# EAGLE design boardv2_copy3 (EAGLE 7.7.0)
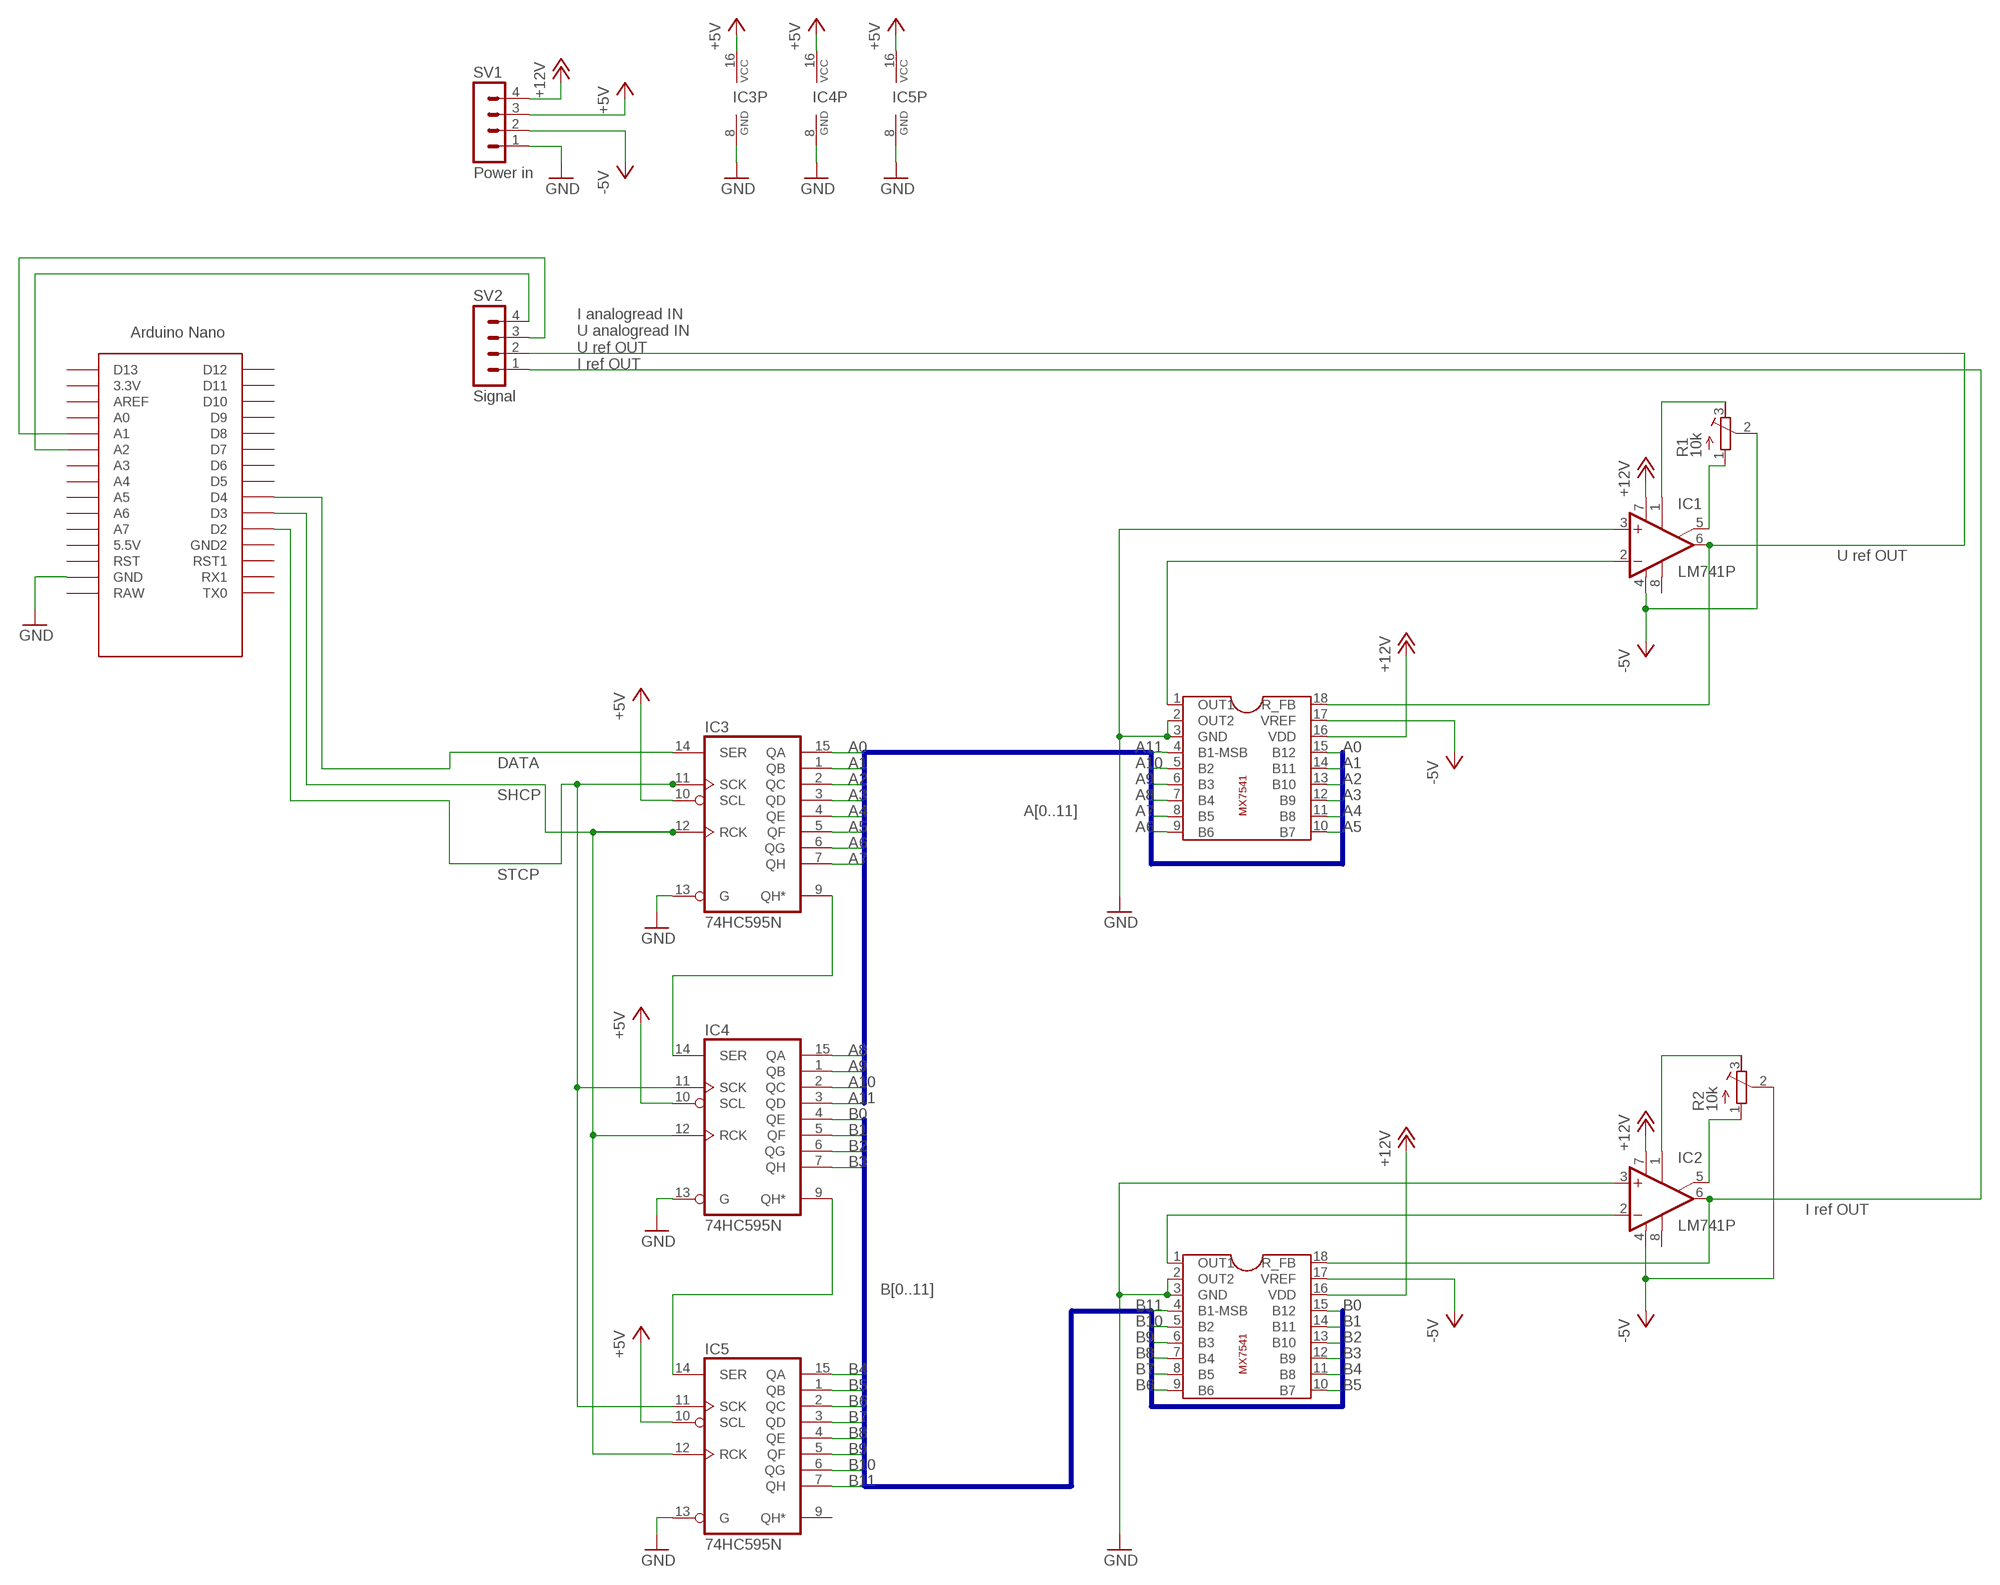
[diagram p0: schematic, sheet 1]

## Parts
IC1  LM741P  [DIL08]
IC2  LM741P  [DIL08]
IC3  74HC595N  [DIL16]
IC4  74HC595N  [DIL16]
IC5  74HC595N  [DIL16]
R1  10k  R-TRIMM64W  [RTRIM64W]
R2  10k  R-TRIMM64W  [RTRIM64W]
SV1  Power in  MA04-1  [MA04-1]
SV2  Signal  MA04-1  [MA04-1]
U$1  MX7541  [MX7541]
U$2  MX7541  [MX7541]
U$3  NANO  [NANO]

## Nets
+5V: IC3.10(SCL) IC3.16(VCC) IC4.10(SCL) IC4.16(VCC) IC5.10(SCL) IC5.16(VCC) SV1.3
+12V: IC1.7(V+) IC2.7(V+) SV1.4 U$1.16(VDD) U$2.16(VDD)
-5V: IC1.4(V-) IC2.4(V-) R1.2(S) R2.2(S) SV1.2 U$1.17(VREF) U$2.17(VREF)
A0: IC3.15(QA) U$1.15(B12)
A1: IC3.1(QB) U$1.14(B11)
A2: IC3.2(QC) U$1.13(B10)
A3: IC3.3(QD) U$1.12(B9)
A4: IC3.4(QE) U$1.11(B8)
A5: IC3.5(QF) U$1.10(B7)
A6: IC3.6(QG) U$1.9(B6)
A7: IC3.7(QH) U$1.8(B5)
A8: IC4.15(QA) U$1.7(B4)
A9: IC4.1(QB) U$1.6(B3)
A10: IC4.2(QC) U$1.5(B2)
A11: IC4.3(QD) U$1.4(B1-MSB)
B0: IC4.4(QE) U$2.15(B12)
B1: IC4.5(QF) U$2.14(B11)
B2: IC4.6(QG) U$2.13(B10)
B3: IC4.7(QH) U$2.12(B9)
B4: IC5.15(QA) U$2.11(B8)
B5: IC5.1(QB) U$2.10(B7)
B6: IC5.2(QC) U$2.9(B6)
B7: IC5.3(QD) U$2.8(B5)
B8: IC5.4(QE) U$2.7(B4)
B9: IC5.5(QF) U$2.6(B3)
B10: IC5.6(QG) U$2.5(B2)
B11: IC5.7(QH) U$2.4(B1-MSB)
GND: IC1.3(+IN) IC2.3(+IN) IC3.8(GND) IC3.13(G) IC4.8(GND) IC4.13(G) IC5.8(GND) IC5.13(G) SV1.1 U$1.2(OUT2) U$1.3(GND) U$2.2(OUT2) U$2.3(GND) U$3.GND
N$1: IC3.9(QH*) IC4.14(SER)
N$2: IC4.9(QH*) IC5.14(SER)
N$3: IC3.11(SCK) IC4.11(SCK) IC5.11(SCK) U$3.D2
N$4: IC3.12(RCK) IC4.12(RCK) IC5.12(RCK) U$3.D3
N$5: IC3.14(SER) U$3.D4
N$6: SV2.4 U$3.A2
N$7: SV2.3 U$3.A1
N$30: IC1.2(-IN) U$1.1(OUT1)
N$31: IC2.2(-IN) U$2.1(OUT1)
N$32: IC1.1(ON1) R1.3(E)
N$33: IC1.5(ON2) R1.1(A)
N$34: IC2.1(ON1) R2.3(E)
N$35: IC2.5(ON2) R2.1(A)
N$36: IC1.6(OUT) SV2.2 U$1.18(R_FB)
N$37: IC2.6(OUT) SV2.1 U$2.18(R_FB)
Unconnected: IC1.8(OPT) IC2.8(OPT) IC5.9(QH*) U$3.3.3V U$3.5V(5.5V) U$3.A0 U$3.A3 U$3.A4 U$3.A5 U$3.A6 U$3.A7 U$3.AREF U$3.D5 U$3.D6 U$3.D7 U$3.D8 U$3.D9 U$3.D10 U$3.D11 U$3.D12 U$3.D13 U$3.GND1(GND2) U$3.ICSP1 U$3.ICSP2 U$3.ICSP3 U$3.ICSP4 U$3.ICSP5 U$3.ICSP6 U$3.RAW U$3.RST U$3.RST1 U$3.RX1 U$3.TX0

## Buses
A[0..11]
B[0..11]

## Notes on the sheet
- I analogread IN
  U analogread IN
  U ref OUT
  I ref OUT
- U ref OUT
- DATA
- SHCP
- STCP
- I ref OUT

## Library data of the parts
IC1 IC2 = linear:*741: OP AMP
IC3-IC5 = 74xx-eu:74*595: 8-bit SHIFT REGISTER, output latch
R1 R2 = rcl:R-TRIMM: Trimm resistor; SPICEMODEL: X; SPICEPREFIXL: POT
SV1 SV2 = con-lstb:MA04-1: PIN HEADER; OC_FARNELL: unknown; OC_NEWARK: unknown
U$1 U$2 = EKA:MX7541
U$3 = Arduino-clone:NANO: Arduino Nano

## Board
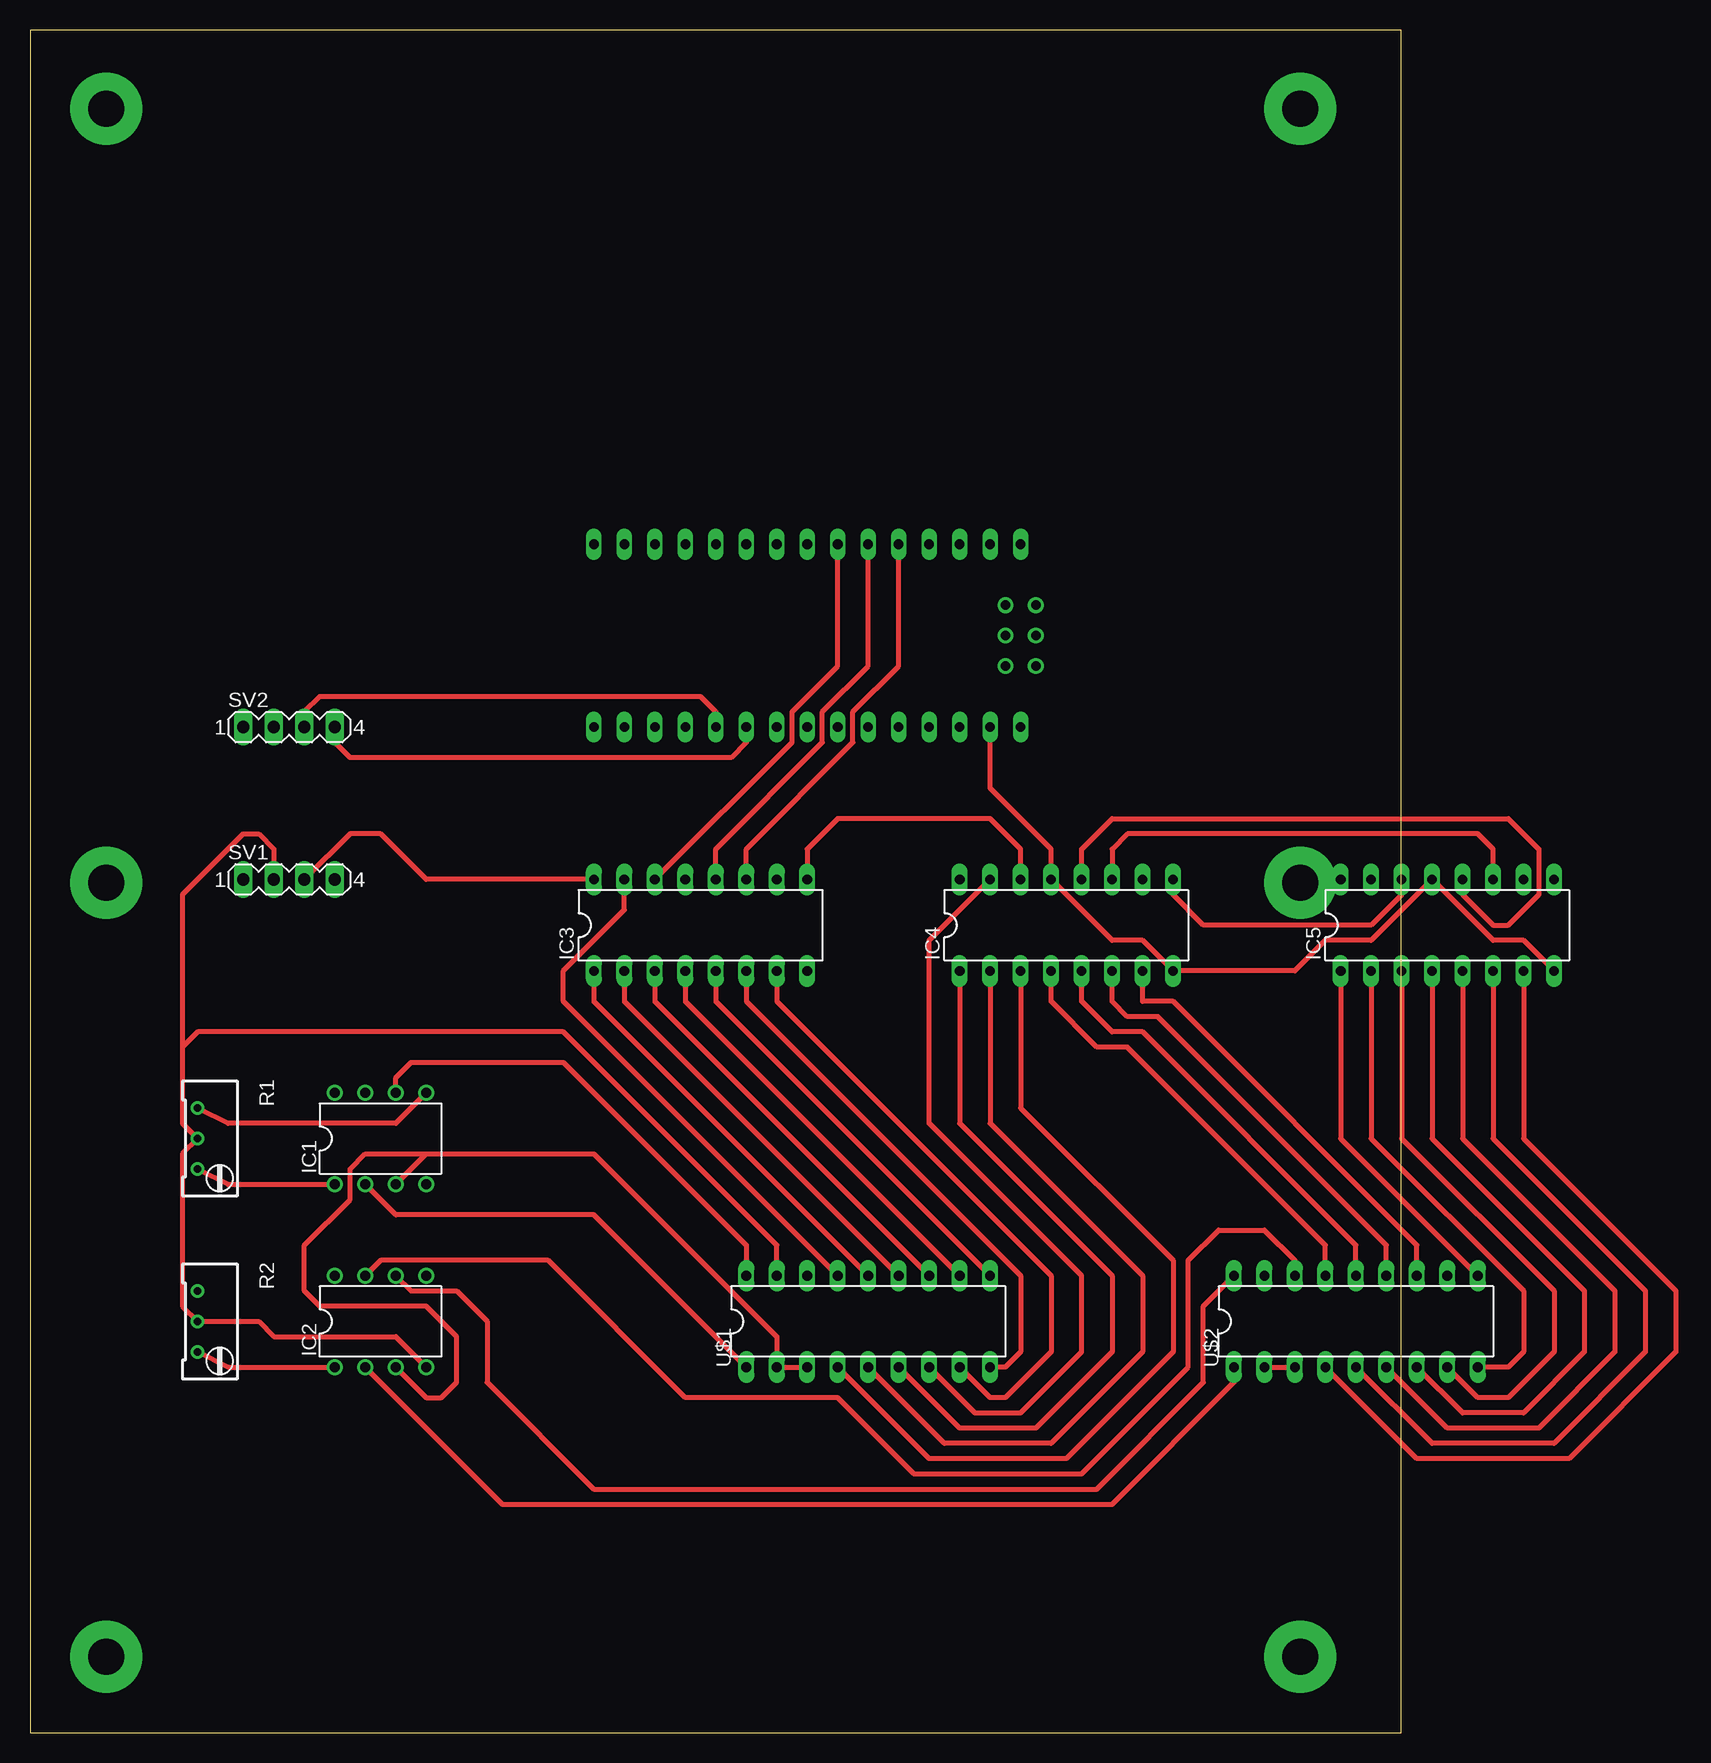
[diagram p1: board, top side]
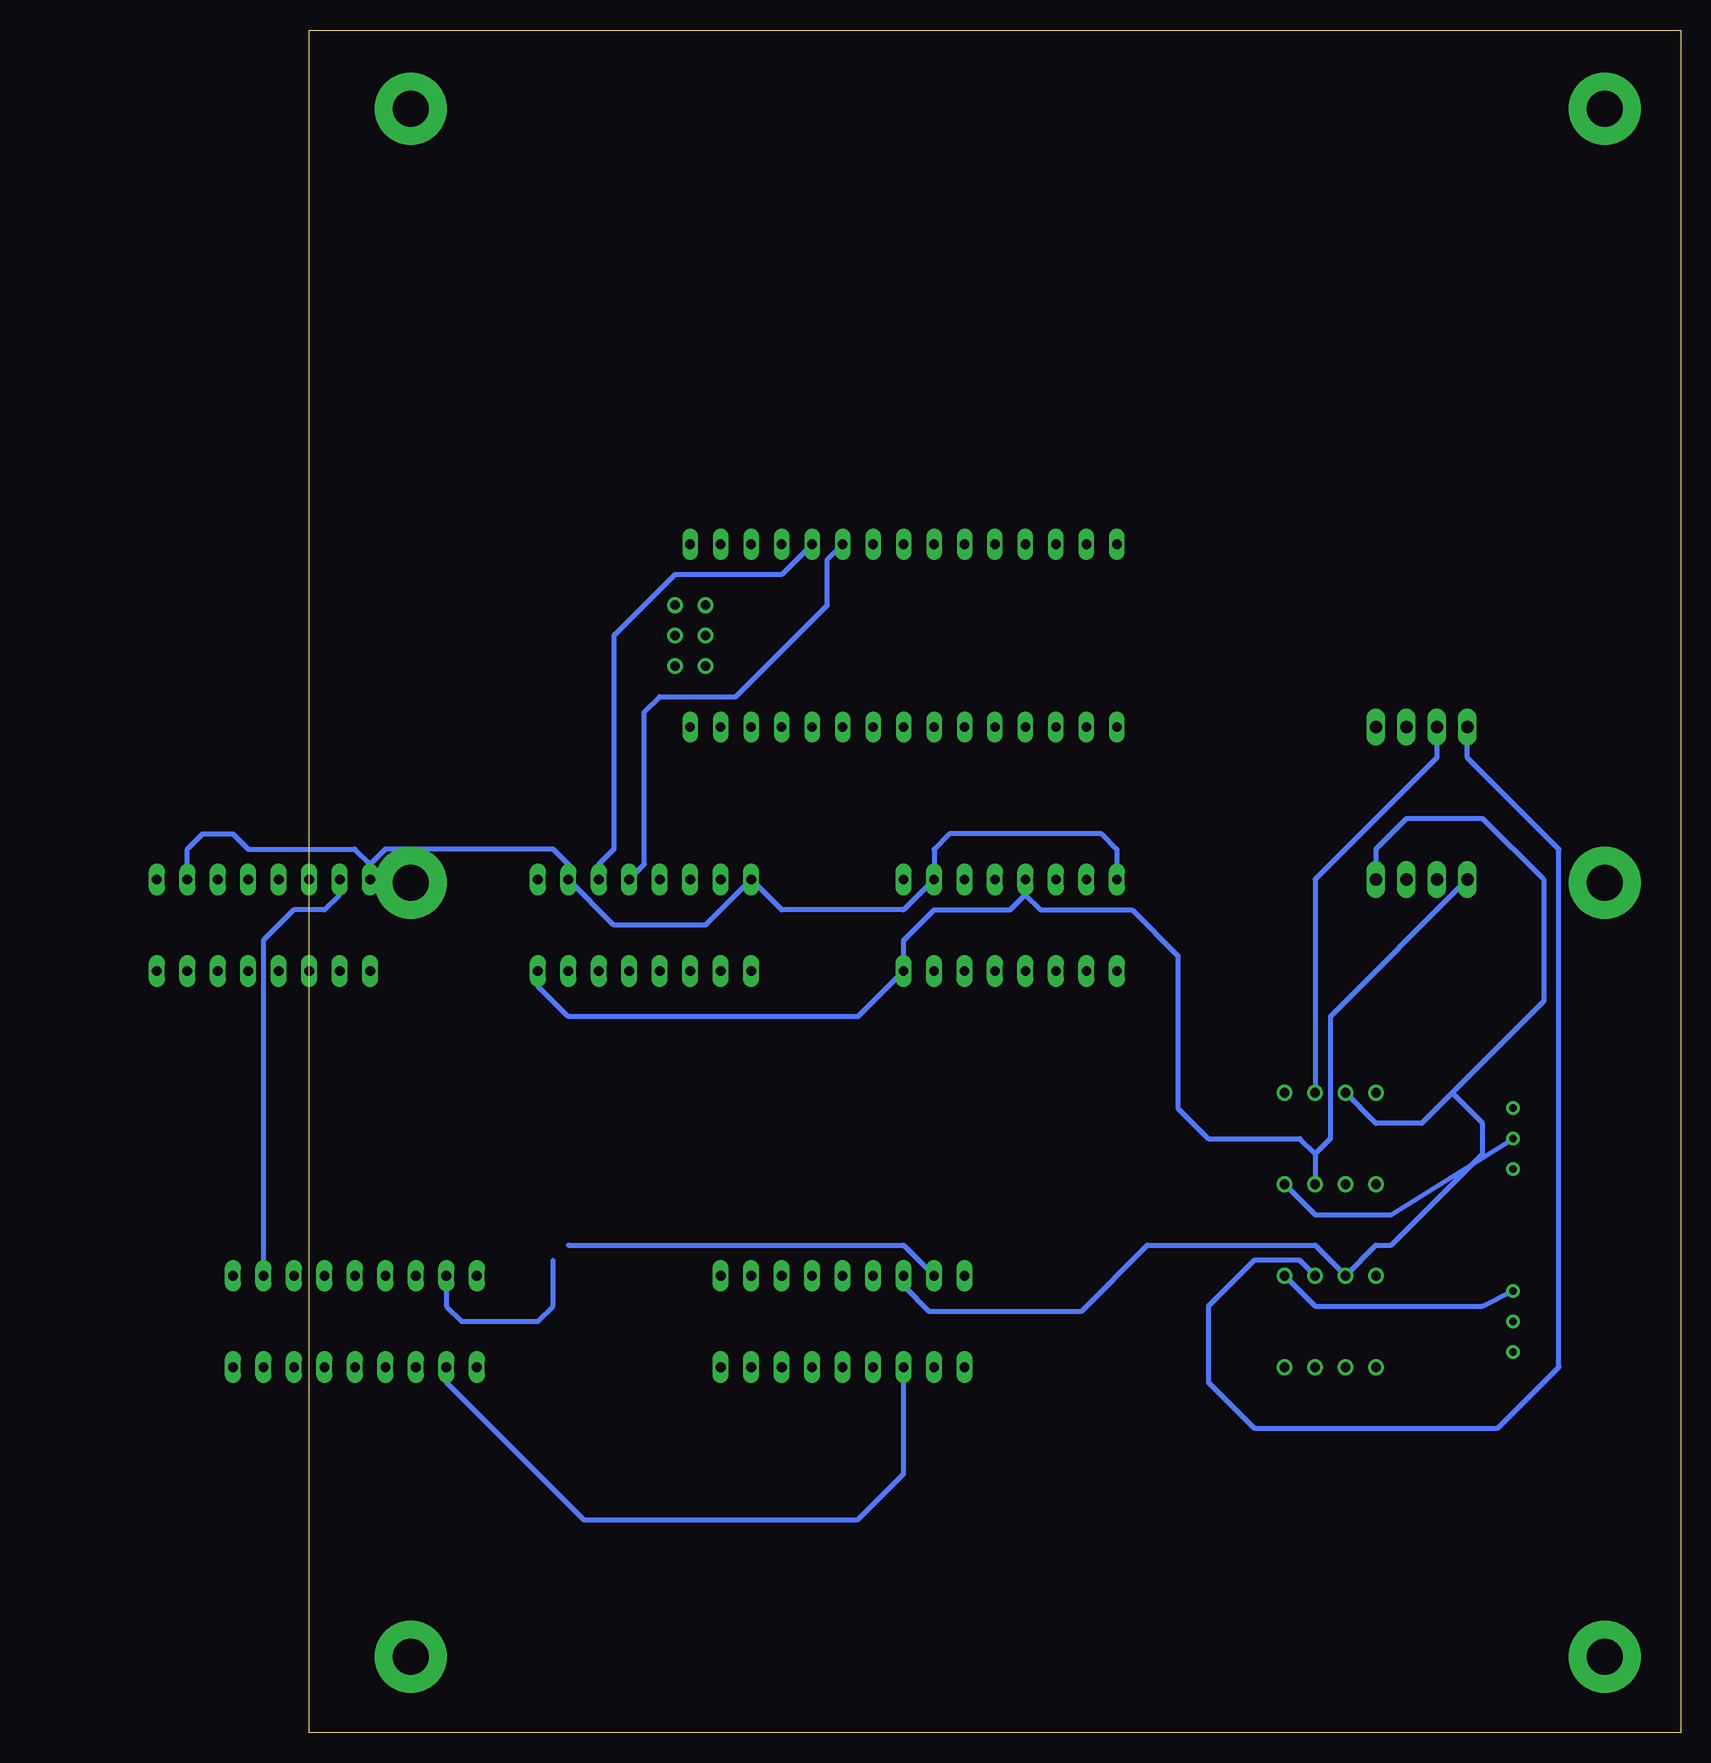
[diagram p2: board, bottom side, seen from below]

Size 114.28 x 141.91 mm. Coordinates in mm from the lower left corner, seen from the top.
Outline: 0,0 114.28,0 114.28,141.91 0,141.91 0,0
Copper layers (1*16): Top 0.035mm / dielectric 1.5mm / Bottom 0.035mm
Design rules "default": minimum track width 6mil, minimum drill 0.35mm, track to track 6mil, track to pad 6mil, pad to pad 6mil, via to via 6mil, smd to smd 6mil, copper to edge 40mil, drill to drill 6mil, minimum pad ring 10mil, minimum via ring 8mil, stop-mask expansion 4mil, vias tented up to drill 0mil, thermal gap 10mil

### Footprints (pad centres in the part's own frame; a part is rotated, then mirrored left to right if it is on the bottom)
DIL08 = drill 0.813 pad 1.27: 1 -3.81,-3.81; 2 -1.27,-3.81; 3 1.27,-3.81; 4 3.81,-3.81; 5 3.81,3.81; 6 1.27,3.81; 7 -1.27,3.81; 8 -3.81,3.81
DIL16 = drill 0.813 long: 1 -8.89,-3.81; 2 -6.35,-3.81; 3 -3.81,-3.81; 4 -1.27,-3.81; 5 1.27,-3.81; 6 3.81,-3.81; 7 6.35,-3.81; 8 8.89,-3.81; 9 8.89,3.81; 10 6.35,3.81; 11 3.81,3.81; 12 1.27,3.81; 13 -1.27,3.81; 14 -3.81,3.81; 15 -6.35,3.81; 16 -8.89,3.81
RTRIM64W = drill 0.61: 1 1.27,-2.54; 2 1.27,0; 3 1.27,2.54
MA04-1 = drill 1.016 long: 1 -3.81,0; 2 -1.27,0; 3 1.27,0; 4 3.81,0
MX7541 = drill 0.813 long: 1 -10.16,-3.81; 2 -7.62,-3.81; 3 -5.08,-3.81; 4 -2.54,-3.81; 5 0,-3.81; 6 2.54,-3.81; 7 5.08,-3.81; 8 7.62,-3.81; 9 10.16,-3.81; 10 10.16,3.81; 11 7.62,3.81; 12 5.08,3.81; 13 2.54,3.81; 14 0,3.81; 15 -2.54,3.81; 16 -5.08,3.81; 17 -7.62,3.81; 18 -10.16,3.81
NANO = drill 0.8 long: 3.3V -10.16,24.13; 5V -10.16,-1.27; A0 -10.16,19.05; A1 -10.16,16.51; A2 -10.16,13.97; A3 -10.16,11.43; A4 -10.16,8.89; A5 -10.16,6.35; A6 -10.16,3.81; A7 -10.16,1.27; AREF -10.16,21.59; D2 5.08,1.27; D3 5.08,3.81; D4 5.08,6.35; D5 5.08,8.89; D6 5.08,11.43; D7 5.08,13.97; D8 5.08,16.51; D9 5.08,19.05; D10 5.08,21.59; D11 5.08,24.13; D12 5.08,26.67; D13 -10.16,26.67; GND -10.16,-6.35; GND1 5.08,-1.27; RAW -10.16,-8.89; RST -10.16,-3.81; RST1 5.08,-3.81; RX1 5.08,-6.35; TX0 5.08,-8.89 | drill 0.8: ICSP1 -5.08,-10.16; ICSP2 -5.08,-7.62; ICSP3 -2.54,-10.16; ICSP4 -2.54,-7.62; ICSP5 0,-10.16; ICSP6 0,-7.62

### Placement (x,y rotation side)
IC1  29.21,49.53 0 top
IC2  29.21,34.29 0 top
IC3  55.88,67.31 0 top
IC4  86.36,67.31 0 top
IC5  118.11,67.31 0 top
R1  15.24,49.53 180 top
R2  15.24,34.29 180 top
SV1  21.59,71.12 0 top
SV2  21.59,83.82 0 top
U$1  69.85,34.29 0 top
U$2  110.49,34.29 0 top
U$3  73.66,93.98 90 top

### Tracks (layer width: path | path; a pad name or v marks a point on that pad's centre or on a via)
+5V
  Top 0.406: IC3.16 33.02,71.12 29.21,74.93 26.67,74.93 SV1.3
  Bottom 0.406: IC3.16 46.99,73.66 48.26,74.93 60.96,74.93 62.23,73.66 IC3.10 64.77,68.58 74.93,68.58 IC4.16 81.28,67.31 88.9,67.31 IC4.10 92.71,72.39 93.98,73.66 107.95,73.66 109.22,72.39 | IC5.10 124.46,73.66 123.19,74.93 120.65,74.93 119.38,73.66 110.49,73.66 109.22,72.39 | 109.22,72.39 IC5.16
+12V
  Top 0.406: IC2.7 29.21,39.37 43.18,39.37 54.61,27.94 67.31,27.94 73.66,21.59 87.63,21.59 96.52,30.48 96.52,39.37 99.06,41.91 102.87,41.91 105.41,39.37 U$2.16
  Bottom 0.406: U$1.16 64.77,37.27 62.65,35.15 49.94,35.15 44.45,40.64 30.48,40.64 IC2.7 25.4,40.64 24.13,40.64 16.51,48.26 16.51,50.8 19.05,53.34 | SV1.4 25.4,73.66 22.86,76.2 16.51,76.2 11.43,71.12 11.43,60.96 19.05,53.34 | IC1.7 25.4,50.8 21.59,50.8 19.05,53.34
-5V
  Top 0.406: U$1.17 62.23,40.64 44.45,58.42 13.97,58.42 12.7,57.15 | 12.7,57.15 12.7,50.8 R1.2 12.7,48.26 12.7,35.56 R2.2 19.05,34.29 20.32,33.02 30.48,33.02 IC2.4 | SV1.2 20.32,73.66 19.05,74.93 17.78,74.93 12.7,69.85 12.7,57.15
  Bottom 0.406: IC1.4 30.48,43.18 24.13,43.18 R1.2 | U$2.17 102.87,35.56 101.6,34.29 95.25,34.29 93.98,35.56 93.98,39.37 | 92.71,40.64 64.77,40.64 U$1.17
A0
  Top 0.406: 49.53,69.85 IC3.15 49.53,68.58 44.45,63.5 44.45,60.96 U$1.15
A1
  Top 0.406: U$1.14 46.99,60.96 IC3.1
A2
  Top 0.406: U$1.13 49.53,60.96 IC3.2
A3
  Top 0.406: U$1.12 52.07,60.96 IC3.3
A4
  Top 0.406: U$1.11 54.61,60.96 IC3.4
A5
  Top 0.406: U$1.10 57.15,60.96 IC3.5
A6
  Top 0.406: IC3.6 59.69,60.96 82.55,38.1 82.55,31.75 81.28,30.48 U$1.9
A7
  Top 0.406: IC3.7 62.23,60.96 85.09,38.1 85.09,31.75 81.28,27.94 80.01,27.94 U$1.8
A8
  Top 0.406: U$1.7 78.74,26.67 82.55,26.67 87.63,31.75 87.63,38.1 74.93,50.8 74.93,66.04 IC4.15
A9
  Top 0.406: IC4.1 77.47,50.8 90.17,38.1 90.17,31.75 83.82,25.4 77.47,25.4 U$1.6
A10
  Top 0.406: IC4.2 80.01,50.8 92.71,38.1 92.71,31.75 85.09,24.13 76.2,24.13 U$1.5
A11
  Top 0.406: IC4.3 82.55,52.07 95.25,39.37 95.25,31.75 86.36,22.86 74.93,22.86 U$1.4
B0
  Top 0.406: IC4.4 85.09,60.96 88.9,57.15 91.44,57.15 107.95,40.64 U$2.15
B1
  Top 0.406: IC4.5 87.63,60.96 90.17,58.42 92.71,58.42 110.49,40.64 U$2.14
B2
  Top 0.406: IC4.6 90.17,60.96 91.44,59.69 93.98,59.69 113.03,40.64 U$2.13
B3
  Top 0.406: IC4.7 92.71,60.96 95.25,60.96 115.57,40.64 U$2.12
B4
  Bottom 0.406: IC5.15 111.76,69.85 113.03,68.58 115.57,68.58 118.11,66.04 U$2.11
B5
  Top 0.406: IC5.1 109.22,49.53 U$2.10
B6
  Top 0.406: IC5.2 111.76,49.53 124.46,36.83 124.46,31.75 123.19,30.48 U$2.9
B7
  Top 0.406: IC5.3 114.3,49.53 127,36.83 127,31.75 123.19,27.94 120.65,27.94 U$2.8
B8
  Top 0.406: IC5.4 116.84,49.53 129.54,36.83 129.54,31.75 124.46,26.67 119.38,26.67 U$2.7
B9
  Top 0.406: IC5.5 119.38,49.53 132.08,36.83 132.08,31.75 125.73,25.4 118.11,25.4 U$2.6
B10
  Top 0.406: IC5.6 121.92,49.53 134.62,36.83 134.62,31.75 127,24.13 116.84,24.13 U$2.5
B11
  Top 0.406: IC5.7 124.46,49.53 137.16,36.83 137.16,31.75 128.27,22.86 115.57,22.86 U$2.4
GND
  Top 0.406: 33.02,48.26 46.99,48.26 62.23,33.02 U$1.2 U$1.3 | IC1.3 33.02,48.26 | U$2.2 U$2.3 | IC5.8 124.46,66.04 121.92,66.04 IC5.13 111.76,66.04 107.95,66.04 105.41,63.5 IC4.8 92.71,66.04 90.17,66.04 IC4.13 85.09,73.66 80.01,78.74 U$3.GND | IC2.3 33.02,27.94 34.29,27.94 35.56,29.21 35.56,33.02 33.02,35.56 24.13,35.56 22.86,36.83 22.86,40.64 26.67,44.45 26.67,46.99 27.94,48.26 33.02,48.26
  Bottom 0.406: IC4.8 95.25,62.23 92.71,59.69 68.58,59.69 IC3.8 64.77,66.04 62.23,68.58 55.88,68.58 54.61,69.85 | U$2.2 102.87,29.21 91.44,17.78 68.58,17.78 64.77,21.59 U$1.3 | IC3.13 54.61,69.85 | 54.61,69.85 53.34,68.58 45.72,68.58 41.91,64.77 41.91,52.07 39.37,49.53 31.75,49.53 30.48,48.26 | 30.48,48.26 IC1.3 | SV1.1 29.21,59.69 29.21,49.53 30.48,48.26
N$1
  Top 0.406: IC4.14 82.55,73.66 80.01,76.2 67.31,76.2 64.77,73.66 IC3.9
N$2
  Top 0.406: IC5.14 114.3,69.85 111.76,67.31 97.79,67.31 95.25,69.85 IC4.9
N$3
  Top 0.406: IC3.11 59.69,73.66 68.58,82.55 68.58,85.09 72.39,88.9 U$3.D2 | IC5.11 121.92,73.66 120.65,74.93 91.44,74.93 90.17,73.66 IC4.11
  Bottom 0.406: IC4.11 90.17,72.39 88.9,73.66 88.9,91.44 83.82,96.52 74.93,96.52 U$3.D2
N$4
  Top 0.406: IC3.12 57.15,73.66 66.04,82.55 66.04,85.09 69.85,88.9 U$3.D3 | IC5.12 119.38,69.85 121.92,67.31 123.19,67.31 125.73,69.85 125.73,73.66 123.19,76.2 90.17,76.2 87.63,73.66 IC4.12
  Bottom 0.406: IC4.12 86.36,72.39 86.36,85.09 85.09,86.36 78.74,86.36 71.12,93.98 71.12,97.79 U$3.D3
N$5
  Top 0.406: IC3.14 63.5,82.55 63.5,85.09 67.31,88.9 U$3.D4
N$6
  Top 0.406: U$3.A2 59.69,82.55 58.42,81.28 26.67,81.28 25.4,82.55 SV2.4
N$7
  Top 0.406: U$3.A1 57.15,85.09 55.88,86.36 24.13,86.36 22.86,85.09 SV2.3
N$8  (via drill 3 pad 6)
  other vias: 6.35,6.35
N$9  (via drill 3 pad 6)
  other vias: 105.85,6.35
N$10  (via drill 3 pad 6)
  other vias: 6.35,70.85
N$11  (via drill 3 pad 6)
  other vias: 105.85,70.85
N$12  (via drill 3 pad 6)
  other vias: 6.35,135.35
N$13  (via drill 3 pad 6)
  other vias: 105.85,135.35
N$30
  Top 0.406: IC1.2 30.48,43.18 46.99,43.18 U$1.1
N$31
  Top 0.406: U$2.1 100.33,29.21 90.17,19.05 39.37,19.05 IC2.2
N$32
  Top 0.406: R1.3 16.51,45.72 IC1.1
N$33
  Top 0.406: IC1.5 30.48,50.8 16.51,50.8 R1.1
N$34
  Top 0.406: R2.3 16.51,30.48 IC2.1
N$35
  Bottom 0.406: R2.1 16.51,35.56 30.48,35.56 IC2.5
N$36
  Top 0.406: IC1.6 30.48,54.61 31.75,55.88 44.45,55.88 59.69,40.64 U$1.18
  Bottom 0.406: SV2.2 20.32,81.28 30.48,71.12 IC1.6
N$37
  Top 0.406: IC2.6 31.75,36.83 35.56,36.83 38.1,34.29 38.1,29.21 46.99,20.32 88.9,20.32 97.79,29.21 97.79,35.56 U$2.18
  Bottom 0.406: IC2.6 31.75,39.37 35.56,39.37 39.37,35.56 39.37,29.21 35.56,25.4 15.24,25.4 10.16,30.48 10.16,73.66 17.78,81.28 SV2.1